# EAGLE design PHAS-Hub (EAGLE 9.0.1)
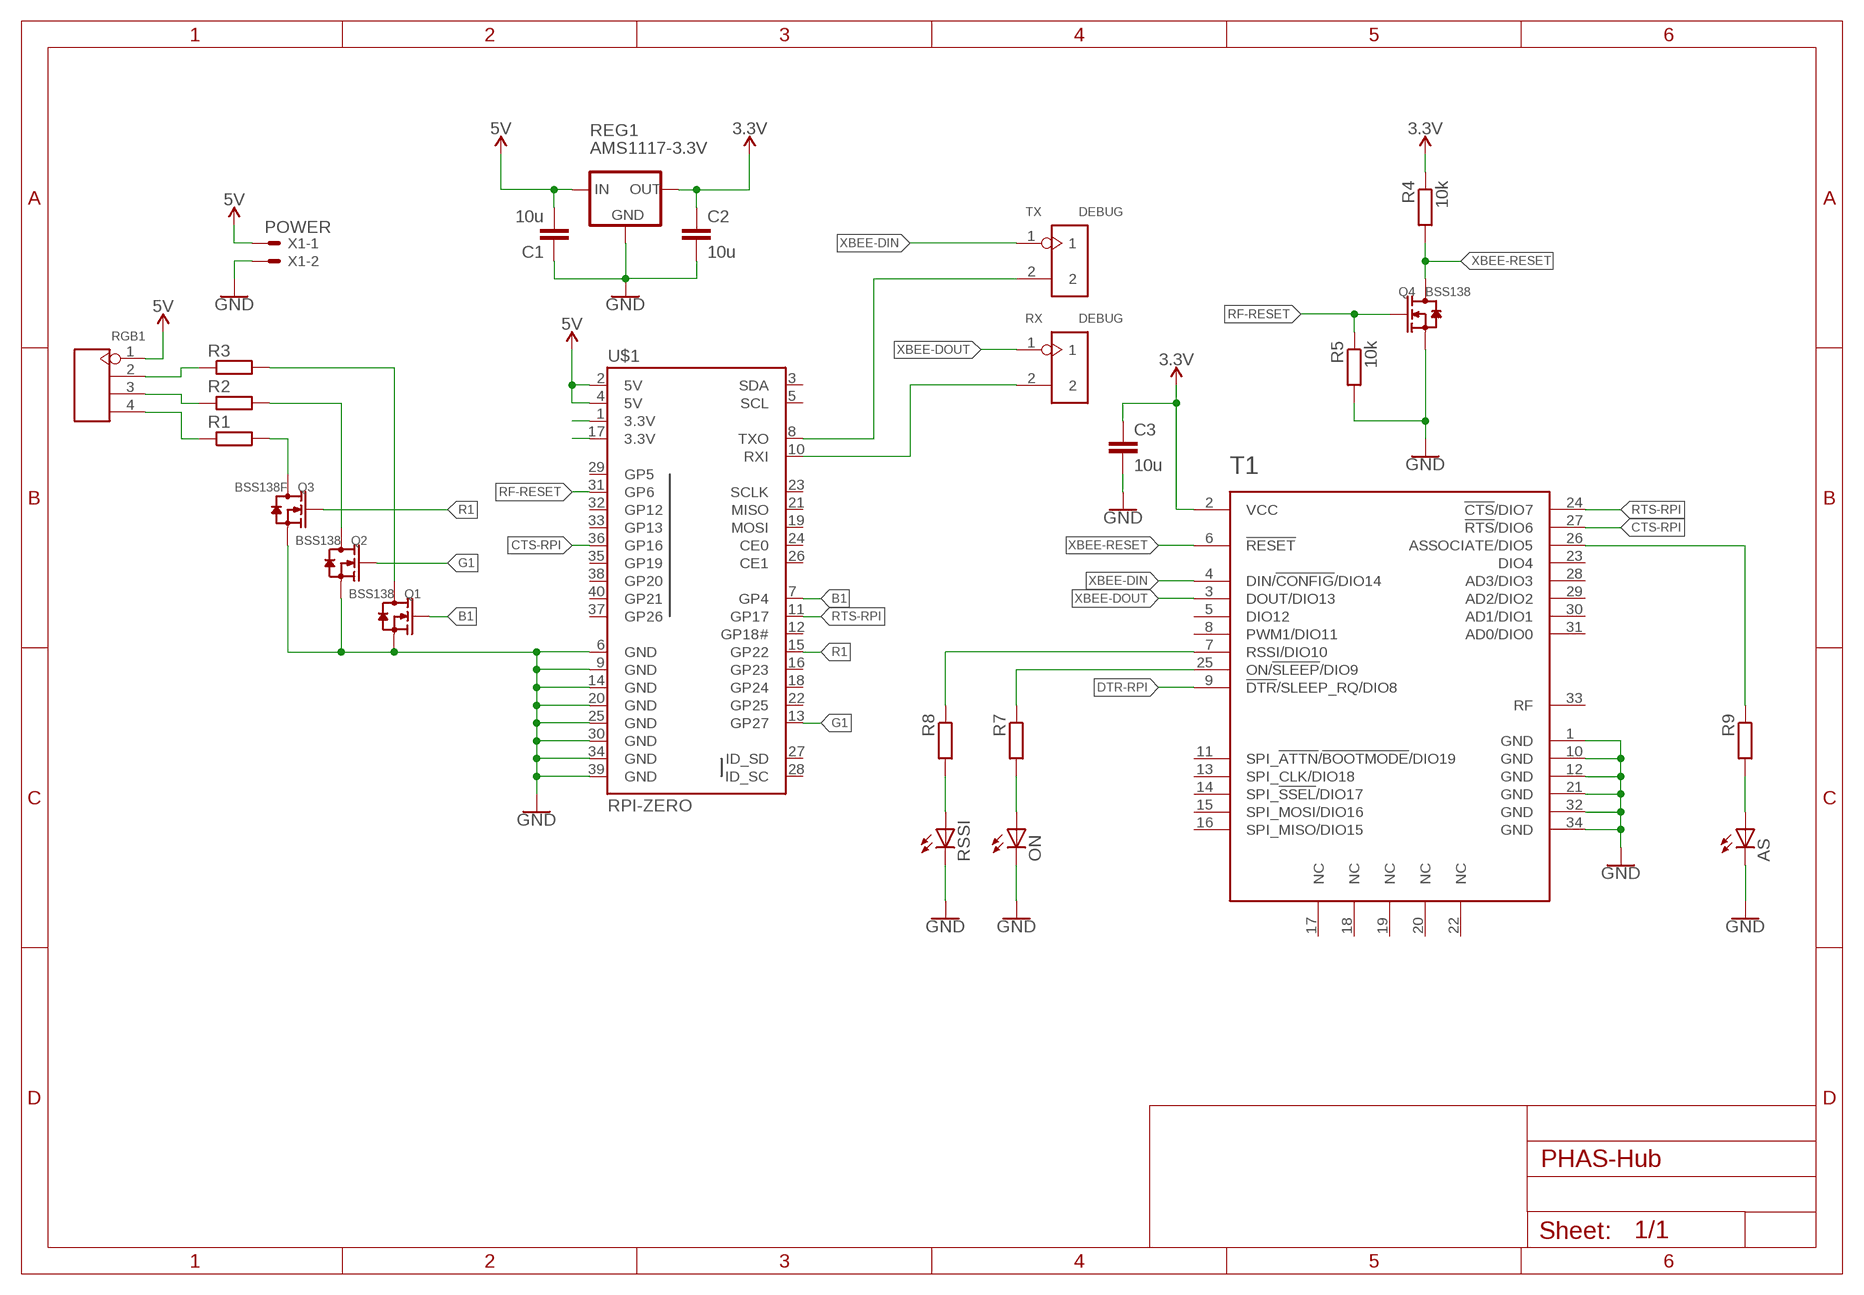
[diagram p0: schematic, sheet 1]

## Parts
AS  LEDCHIPLED_0805  [CHIPLED_0805]
C1  10u  C-EUC0805  [C0805]
C2  10u  C-EUC0805  [C0805]
C3  10u  C-EUC0805  [C0805]
ON  LEDCHIPLED_0805  [CHIPLED_0805]
Q1  BSS138  SMD-MOSFET-N-CH-50V-200MA-BSS138W-7-F(SOT-23)  [SOT-23]
Q2  BSS138  SMD-MOSFET-N-CH-50V-200MA-BSS138W-7-F(SOT-23)  [SOT-23]
Q3  BSS138F  SMD-MOSFET-N-CH-50V-200MA-BSS138W-7-F(SOT-23)  [SOT-23]
Q4  BSS138  SMD-MOSFET-N-CH-50V-200MA-BSS138W-7-F(SOT-23)  [SOT-23]
R1  R-EU_R0805  [R0805]
R2  R-EU_R0805  [R0805]
R3  R-EU_R0805  [R0805]
R4  10k  R-EU_R0805  [R0805]
R5  10k  R-EU_R0805  [R0805]
R7  R-EU_R0805  [R0805]
R8  R-EU_R0805  [R0805]
R9  R-EU_R0805  [R0805]
REG1  AMS1117-3.3V  LM1117MP-3.3  [SOT223]
RGB1  DIP-BLACK-MALE-HEADER-VERT(4P-2.54)  [H4-2.54]
RSSI  LEDCHIPLED_0805  [CHIPLED_0805]
RX  DEBUG  DIP-BLACK-MALE-HEADER-VERT(2P-2.54)  [H2-2.54]
T1  XBEE3-MICRO  [XBEE3-MICRO]
TX  DEBUG  DIP-BLACK-MALE-HEADER-VERT(2P-2.54)  [H2-2.54]
U$1  RPI-ZERO  [RASPBERRYPI_BASTELSTUBE_V13_RASPI_BOARD_B+_FULL]
X1  POWER  C-GRID-02-70543  [70543-02]

## Nets
3.3V: C2.1 C3.1 R4.1 REG1.2(OUT) REG1.4(OUT) T1.2(VCC)
5V: C1.2 REG1.3(IN) RGB1.1 U$1.2(5V) U$1.4(5V) X1.1
B1: Q1.1(G) U$1.7(GP4)
CTS-RPI: T1.27(!RTS!/DIO6) U$1.36(GP16)
DTR-RPI: T1.9(!DTR!/SLEEP_RQ/DIO8)
G1: Q2.1(G) U$1.13(GP27)
GND: AS.C C1.1 C2.2 C3.2 ON.C Q1.2(S) Q2.2(S) Q3.2(S) Q4.2(S) R5.2 REG1.1(GND) RSSI.C T1.1(GND) T1.10(GND) T1.12(GND) T1.21(GND) T1.32(GND) T1.34(GND) U$1.6(GND) U$1.9(GND) U$1.14(GND) U$1.20(GND) U$1.25(GND) U$1.30(GND) U$1.34(GND) U$1.39(GND) X1.2
N$1: TX.2 U$1.8(TXO)
N$2: RX.2 U$1.10(RXI)
N$3: Q3.3(D) R1.2
N$4: Q2.3(D) R2.2
N$5: Q1.3(D) R3.2
N$6: AS.A R9.2
N$7: R7.1 T1.25(ON/!SLEEP!/DIO9)
N$8: R8.2 RSSI.A
N$9: R3.1 RGB1.2
N$10: R2.1 RGB1.3
N$11: R1.1 RGB1.4
N$12: ON.A R7.2
N$13: U$1.1(3.3V)
N$14: U$1.17(3.3V)
N$18: R8.1 T1.7(RSSI/DIO10)
N$20: R9.1 T1.26(ASSOCIATE/DIO5)
R1: Q3.1(G) U$1.15(GP22)
RF-RESET: Q4.1(G) R5.1 U$1.31(GP6)
RTS-RPI: T1.24(!CTS!/DIO7) U$1.11(GP17)
XBEE-DIN: T1.4(DIN/!CONFIG!/DIO14) TX.1
XBEE-DOUT: RX.1 T1.3(DOUT/DIO13)
XBEE-RESET: Q4.3(D) R4.2 T1.6(!RESET!)
Unconnected: T1.5(DIO12) T1.8(PWM1/DIO11) T1.11(SPI_!ATTN!/!BOOTMODE!/DIO19) T1.13(SPI_CLK/DIO18) T1.14(SPI_!SSEL!/DIO17) T1.15(SPI_MOSI/DIO16) T1.16(SPI_MISO/DIO15) T1.17(NC) T1.18(NC) T1.19(NC) T1.20(NC) T1.22(NC) T1.23(DIO4) T1.28(AD3/DIO3) T1.29(AD2/DIO2) T1.30(AD1/DIO1) T1.31(AD0/DIO0) T1.33(RF) U$1.3(SDA) U$1.5(SCL) U$1.12(GP18#) U$1.16(GP23) U$1.18(GP24) U$1.19(MOSI) U$1.21(MISO) U$1.22(GP25) U$1.23(SCLK) U$1.24(CE0) U$1.26(CE1) U$1.27(ID_SD) U$1.28(ID_SC) U$1.29(GP5) U$1.32(GP12) U$1.33(GP13) U$1.35(GP19) U$1.37(GP26) U$1.38(GP20) U$1.40(GP21)

## Library data of the parts
AS ON RSSI = led:LED: LED OSRAM: - CHIPLED LG R971, LG N971, LY N971, LG Q971, LY Q971, LO R971, LY R971 LH N974, LH R974 LS Q976, LO Q976, LY Q976 LO Q996 - Hyper CHIPLED LW Q18S LB Q993, LB Q99A, LB R99A - SideLED LS A670, LO A670, LY A670, LG A670, LP A670 LB A673, LV A673, LT A673, LW A673 LH A674 LY A675 LS A676, LA A676, LO A676, LY A676, LW A676 LS A679, LY A679, LG A679 - Hyper Micro SIDELED® LS Y876, LA Y876, LO Y876, LY Y876 LT Y87S - SmartLED LW L88C, LW L88S LB L89C, LB L89S, LG L890 LS L89K, LO L89K, LY L89K LS L896, LA L896, LO L896, LY L896 - TOPLED LS T670, LO T670, LY T670, LG T670, LP T670 LSG T670, LSP T670, LSY T670, LOP T670, LYG T670 LG T671, LOG T671, LSG T671 LB T673, LV T673, LT T673, LW T673 LH T674 LS T676, LA T676, LO T676, LY T676, LB T676, LH T676, LSB T676, LW T676 LB T67C, LV T67C, LT T67C, LS T67K, LO T67K, LY T67K, LW E67C LS E67B, LA E67B, LO E67B, LY E67B, LB E67C, LV E67C, LT E67C LW T67C LS T679, LY T679, LG T679 LS T770, LO T770, LY T770, LG T770, LP T770 LB T773, LV T773, LT T773, LW T773 LH T774 LS E675, LA E675, LY E675, LS T675 LS T776, LA T776, LO T776, LY T776, LB T776 LHGB T686 LT T68C, LB T68C - Hyper Mini TOPLED® LB M676 - Mini TOPLED Santana® LG M470 LS M47K, LO M47K, LY M47K Source: http://www.osram.convergy.de LUXEON: - LUMILED® LXK2-PW12-R00, LXK2-PW12-S00, LXK2-PW14-U00, LXK2-PW14-V00 LXK2-PM12-R00, LXK2-PM12-S00, LXK2-PM14-U00 LXK2-PE12-Q00, LXK2-PE12-R00, LXK2-PE12-S00, LXK2-PE14-T00, LXK2-PE14-U00 LXK2-PB12-K00, LXK2-PB12-L00, LXK2-PB12-M00, LXK2-PB14-N00, LXK2-PB14-P00, LXK2-PB14-Q00 LXK2-PR12-L00, LXK2-PR12-M00, LXK2-PR14-Q00, LXK2-PR14-R00 LXK2-PD12-Q00, LXK2-PD12-R00, LXK2-PD12-S00 LXK2-PH12-R00, LXK2-PH12-S00 LXK2-PL12-P00, LXK2-PL12-Q00, LXK2-PL12-R00 Source: www.luxeon.com KINGBRIGHT: KA-3528ASYC Source: www.kingbright.com
C1-C3 = resistor:C-EU: CAPACITOR, European symbol
Q1-Q4 = Seeed-Transistor:SMD-MOSFET-N-CH-50V-200MA-BSS138W-7-F(SOT-23): 305030000; MPN: BSS138W-7-F; VALUE: BSS138W-7-F
R1-R5 R7-R9 = resistor:R-EU_: RESISTOR, European symbol
REG1 = lm1117_10:LM1117?-*: 800mA Low-Dropout Linear Regulator Source: http://www.ti.com/lit/ds/symlink/lm1117-n.pdf; MF: Texas Instruments; MPN: LM1117MP-3.3; OC_FARNELL: 9778195; OC_NEWARK: 28X3416
RGB1 = Seeed-Connector:DIP-BLACK-MALE-HEADER-VERT(4P-2.54): 320020017; MPN: P125-1104A0BS116A1; VALUE: 4p-2.54
RX TX = Seeed-Connector:DIP-BLACK-MALE-HEADER-VERT(2P-2.54): 320020016; MPN: P125-1102A0BS116A1; VALUE: 2p-2.54
T1 = xbee3_micro:XBEE3-MICRO
U$1 = RPI-Zero:RPI-ZERO
X1 = con-molex:C-GRID-02: CONNECTOR wire to board 2.54 mm (0.100") pitch header; MF: MOLEX; OC_FARNELL: unknown; OC_NEWARK: unknown

## Board
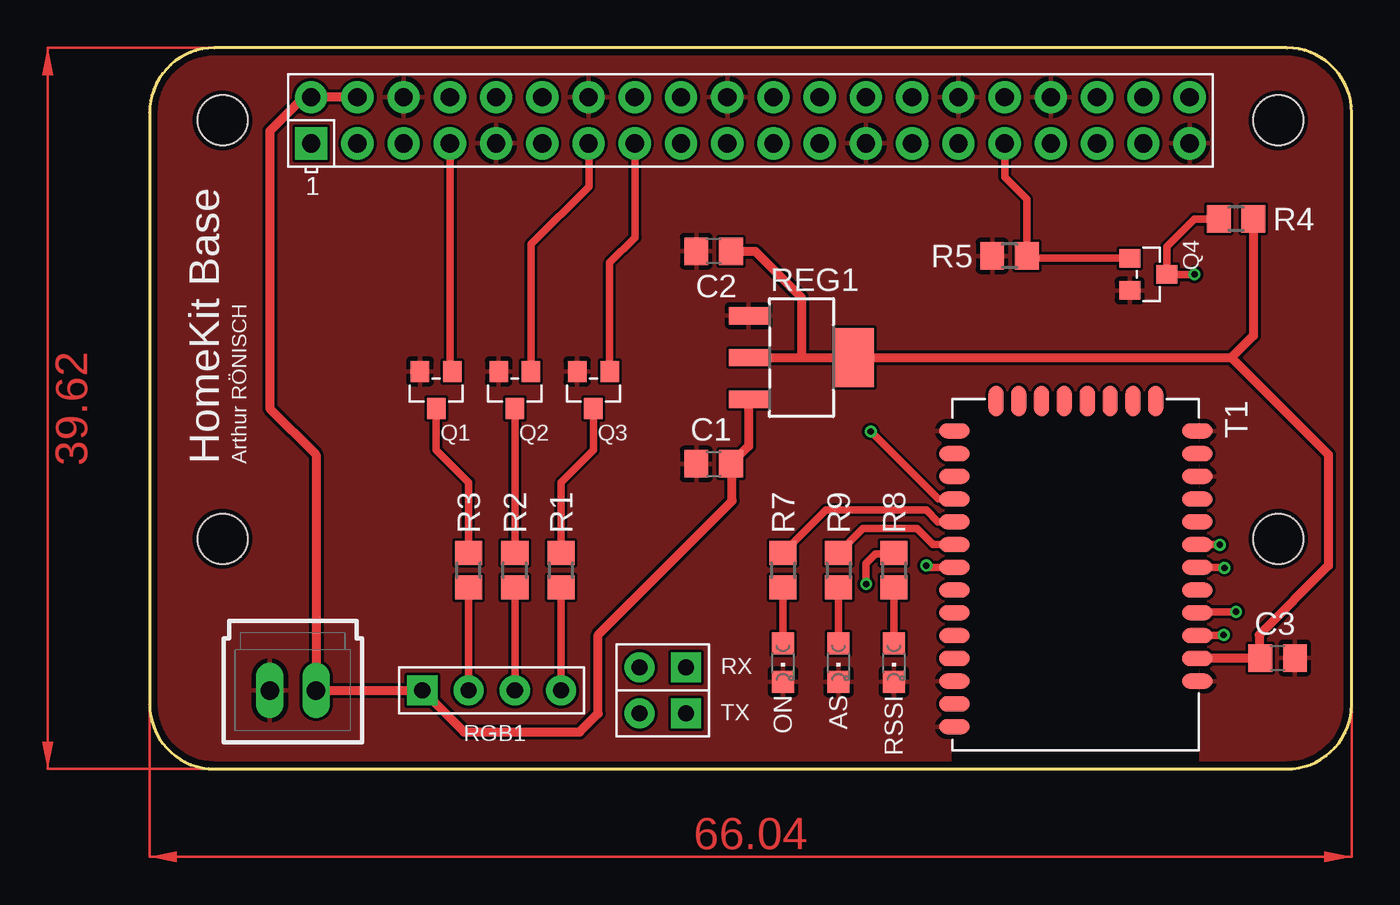
[diagram p1: board, top side]
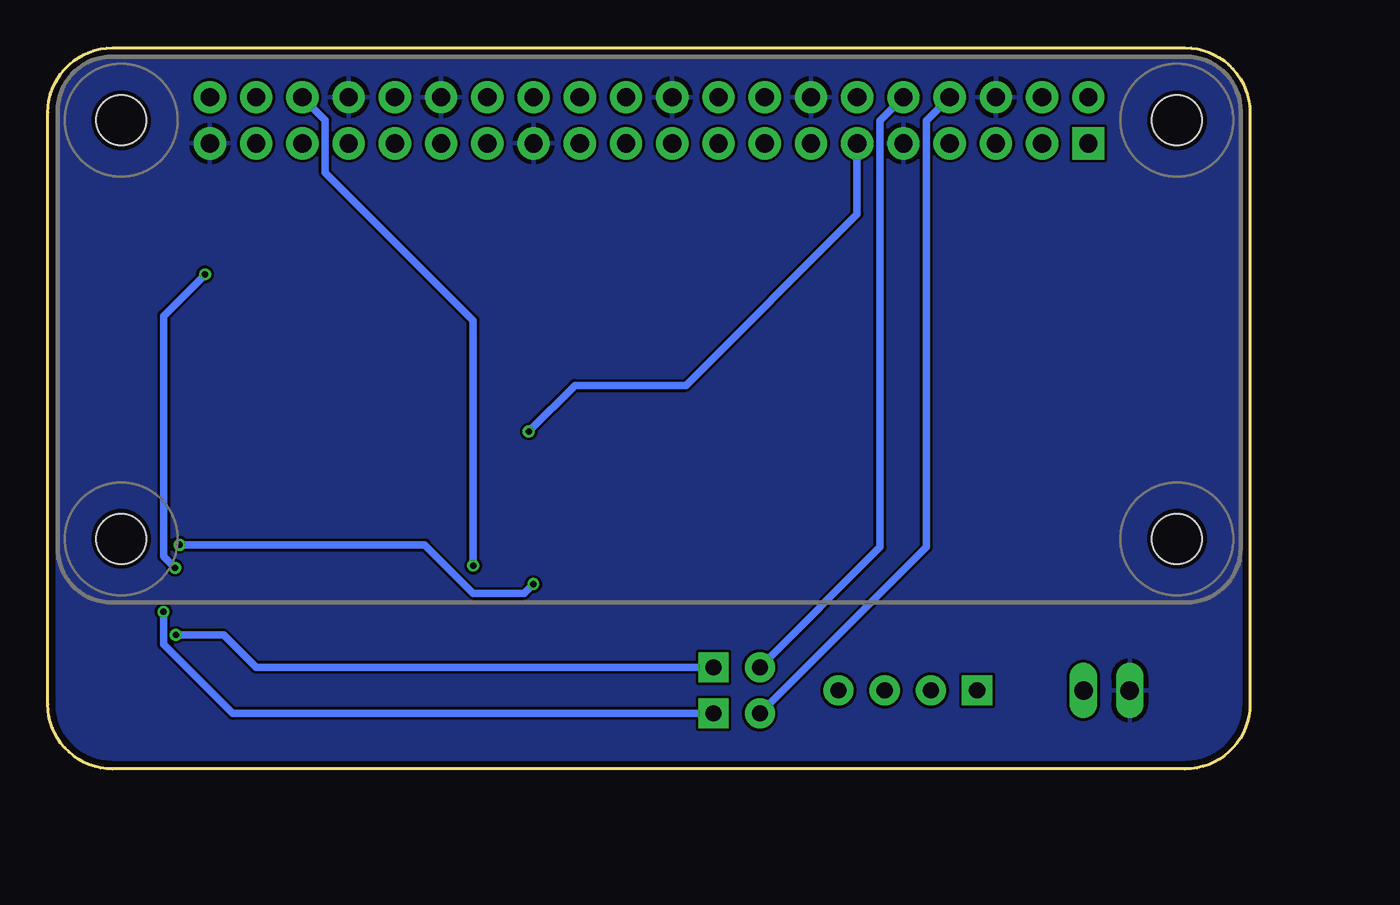
[diagram p2: board, bottom side, seen from below]

Size 66.04 x 39.62 mm. Coordinates in mm from the lower left corner, seen from the top.
Outline: 0,3.56 arc90 3.56,0 62.48,0 arc90 66.04,3.56 66.04,36.07 arc90 62.48,39.62 3.56,39.62 arc90 0,36.07 0,3.56
Copper layers (1*16): Top 0.035mm / dielectric 1.5mm / Bottom 0.035mm
Design rules "SeeedStudio_2layer_DRU_no_angle_20140221": minimum track width 6mil, minimum drill 12mil, track to track 6mil, track to pad 6mil, pad to pad 6mil, via to via 6mil, smd to smd 0mil, copper to edge 10mil, drill to drill 10mil, minimum pad ring 10mil, minimum via ring 6mil, stop-mask expansion 2mil, vias tented up to drill 100mil, thermal gap 10mil
tRestrict: area 44.1,0.4 to 57.7,20.3

### Footprints (pad centres in the part's own frame; a part is rotated, then mirrored left to right if it is on the bottom)
CHIPLED_0805 = smd 1.2 x 1.2: A 0,-1.05; C 0,1.05
C0805 = smd 1.3 x 1.5: 1 -0.95,0; 2 0.95,0
SOT-23 = smd 1.016 x 1.143: 1 -0.889,-1.016; 2 0.889,-1.016; 3 0,1.016
R0805 = smd 1.3 x 1.5: 1 -0.95,0; 2 0.95,0
SOT223 = smd 0.95 x 2.15: 1 -2.3,-2.9; 2 0,-2.9; 3 2.3,-2.9 | smd 3.25 x 2.15: 4 0,2.9
H4-2.54 = drill 0.889 pad 1.651 square: 1 0,3.81 | drill 0.889 pad 1.651: 2 0,1.27; 3 0,-1.27; 4 0,-3.81
H2-2.54 = drill 0.889 pad 1.651 square: 1 0,1.27 | drill 0.889 pad 1.651: 2 0,-1.27
XBEE3-MICRO = smd 1.676 x 0.838: 1 0.102,15.494; 2 0.102,14.244; 3 0.102,12.995; 4 0.102,11.745; 5 0.102,10.495; 6 0.102,9.246; 7 0.102,7.996; 8 0.102,6.746; 9 0.102,5.497; 10 0.102,4.247; 11 0.102,2.997; 12 0.102,1.748; 21 13.437,1.748; 22 13.437,2.997; 23 13.437,4.247; 24 13.437,5.497; 25 13.437,6.746; 26 13.437,7.996; 27 13.437,9.246; 28 13.437,10.495; 29 13.437,11.745; 30 13.437,12.995; 31 13.437,14.244; 32 13.437,15.494; 33 13.437,16.744; 34 13.437,17.993 | smd 0.838 x 1.676: 13 2.388,0.102; 14 3.637,0.102; 15 4.887,0.102; 16 6.137,0.102; 17 7.402,0.102; 18 8.651,0.102; 19 9.901,0.102; 20 11.151,0.102
RASPBERRYPI_BASTELSTUBE_V13_RASPI_BOARD_B+_FULL = drill 1 pad 1.778 square: 1 8.37,25.23 | drill 1 pad 1.778: 2 8.37,27.77; 3 10.91,25.23; 4 10.91,27.77; 5 13.45,25.23; 6 13.45,27.77; 7 15.99,25.23; 8 15.99,27.77; 9 18.53,25.23; 10 18.53,27.77; 11 21.07,25.23; 12 21.07,27.77; 13 23.61,25.23; 14 23.61,27.77; 15 26.15,25.23; 16 26.15,27.77; 17 28.69,25.23; 18 28.69,27.77; 19 31.23,25.23; 20 31.23,27.77; 21 33.77,25.23; 22 33.77,27.77; 23 36.31,25.23; 24 36.31,27.77; 25 38.85,25.23; 26 38.85,27.77; 27 41.39,25.23; 28 41.39,27.77; 29 43.93,25.23; 30 43.93,27.77; 31 46.47,25.23; 32 46.47,27.77; 33 49.01,25.23; 34 49.01,27.77; 35 51.55,25.23; 36 51.55,27.77; 37 54.09,25.23; 38 54.09,27.77; 39 56.63,25.23; 40 56.63,27.77 | hole 2.75: 3.5,3.5; 3.5,26.5; 61.5,3.5; 61.5,26.5
70543-02 = drill 1.016 long: 1 -1.27,0; 2 1.27,0

### Placement (x,y rotation side)
AS  37.85,5.84 180 top
C1  30.99,16.76 0 top
C2  30.99,28.45 180 top
C3  61.98,6.1 0 top
ON  34.8,5.84 180 top
Q1  15.75,20.83 180 top
Q2  20.07,20.83 180 top
Q3  24.38,20.83 180 top
Q4  54.86,27.18 270 top
R1  22.61,10.92 90 top
R2  20.07,10.92 90 top
R3  17.53,10.92 90 top
R4  59.69,30.23 180 top
R5  47.24,28.19 180 top
R7  34.8,10.92 270 top
R8  40.89,10.92 270 top
R9  37.85,10.92 270 top
REG1  35.81,22.61 270 top
RGB1  18.8,4.32 90 top
RSSI  40.89,5.84 180 top
RX  28.19,5.59 270 top
T1  57.66,20.32 180 top
TX  28.19,3.05 270 top
U$1  0.51,9.14 0 top
X1  7.87,4.32 180 top

### Tracks (layer width: path | path; a pad name or v marks a point on that pad's centre or on a via)
3.3V
  Top 0.406: 61.01,6.08 C3.1 60.96,6.16 | T1.2 58.42,6.08
  Top 0.508: REG1.2 35.81,22.61 | 35.81,22.61 REG1.4 59.44,22.61 | C2.1 33.27,28.45 35.81,25.91 35.81,22.61 | 61.01,6.08 58.42,6.08 57.86,6.08 | 59.44,22.61 64.77,17.27 64.77,11.18 60.96,7.37 60.96,6.16 | R4.1 60.64,23.81 59.44,22.61
5V
  Top 0.406: U$1.2 8.47,36.91 | 32,16.7 C1.2
  Top 0.508: U$1.4 U$1.2 | 8.47,36.91 6.6,35.05 6.6,19.81 9.14,17.27 X1.1 RGB1.1 17.27,2.03 23.62,2.03 24.64,3.05 24.64,7.37 32,14.73 32,16.7 | REG1.3 32.91,17.74 C1.2
B1
  Top 0.406: U$1.7 16.5,21.98 Q1.1
CTS-RPI  (via drill 0.35)
  Top 0.406: T1.27 42.77,11.07 v42.67,11.18
  Bottom 0.406: v42.67,11.18 42.67,24.64 50.8,32.77 50.8,35.66 U$1.36
G1
  Top 0.406: Q2.1 20.95,28.83 24.13,32 U$1.13
GND
  pour Top: 0.51,36.07 0.51,3.56 arc90 3.56,0.51 62.48,0.51 arc90 65.53,3.56 65.53,36.07 arc90 62.48,39.12 3.56,39.12 arc90
  pour Bottom: 0.51,36.07 0.51,3.56 arc90 3.56,0.51 62.48,0.51 arc90 65.53,3.56 65.53,36.07 arc90 62.48,39.12 3.56,39.12 arc90
N$1
  Bottom 0.406: TX.2 17.78,12.19 17.78,35.63 U$1.8
N$2
  Bottom 0.406: RX.2 20.32,12.19 20.32,35.63 U$1.10
N$3
  Top 0.406: R1.2 22.61,15.75 24.38,17.53 Q3.3
N$4
  Top 0.406: R2.2 Q2.3
N$5
  Top 0.406: R3.2 17.53,15.75 15.75,17.53 Q1.3
N$6
  Top 0.406: AS.A R9.2
N$7
  Top 0.406: T1.25 43.32,13.57 42.67,14.22 37.15,14.22 R7.1
N$8
  Top 0.406: RSSI.A R8.2
N$9
  Top 0.406: RGB1.2 R3.1
N$10
  Top 0.406: RGB1.3 R2.1
N$11
  Top 0.406: RGB1.4 R1.1
N$12
  Top 0.406: ON.A R7.2
N$18  (via drill 0.35)
  Top 0.406: T1.7 v58.8,12.32 | v39.37,10.16 39.37,11.3 39.88,11.81 40.83,11.81 R8.1
  Bottom 0.406: v58.8,12.32 45.34,12.32 42.67,9.65 39.88,9.65 v39.37,10.16
N$20
  Top 0.406: T1.26 43.05,12.32 42.16,13.21 39.18,13.21 R9.1
R1
  Top 0.406: Q3.1 25.27,27.81 26.67,29.21 U$1.15
RF-RESET
  Top 0.406: U$1.31 46.98,32.52 48.19,31.31 R5.1 48.32,28.07 Q4.1
RTS-RPI  (via drill 0.35)
  Top 0.406: T1.24 43.34,14.82 v39.62,18.54
  Bottom 0.406: v39.62,18.54 37.08,21.08 30.99,21.08 21.58,30.49 U$1.11
XBEE-DIN  (via drill 0.35)
  Top 0.406: v59.69,8.64 58.67,8.64 57.92,8.64 | 57.92,8.64 57.86,8.57 | T1.4 57.62,8.64 57.92,8.64
  Bottom 0.406: TX.1 55.88,3.05 59.69,6.86 v59.69,8.64
XBEE-DOUT  (via drill 0.35)
  Top 0.406: v59.01,7.37 58.97,7.33 58.42,7.33 57.86,7.33 T1.3
  Bottom 0.406: RX.1 54.61,5.59 56.39,7.37 v59.01,7.37
XBEE-RESET  (via drill 0.35)
  Top 0.406: R4.2 57.4,30.23 55.88,28.7 Q4.3 v57.4,27.18 | v59.05,11.05 59.03,11.07 58.42,11.07 57.86,11.07 T1.6
  Bottom 0.406: v57.4,27.18 59.69,24.89 59.69,11.68 v59.05,11.05
(copper drawn outside any net)
  shapes: Top area x2

### Text on the board
tNames: HomeKit Base | Arthur RÖNISCH